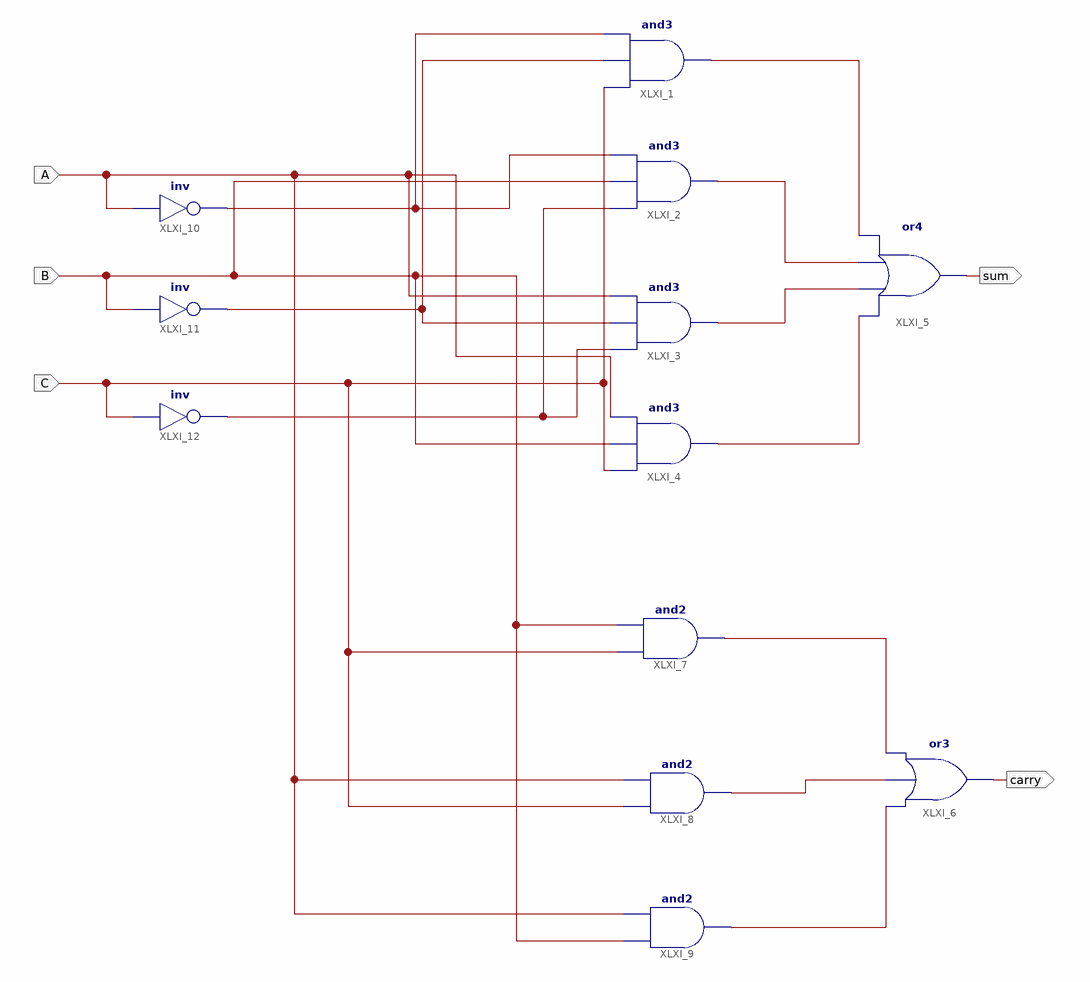
[diagram p0: schematic sheet 1]
// Xilinx ISE schematic full_adder.sch (spartan3adsp) as structural Verilog: 12 symbols, 5 ports
module full_adder (
  input  A,
  input  B,
  input  C,
  output sum,
  output carry
);

  wire XLXN_5, XLXN_6, XLXN_7, XLXN_8, XLXN_9, XLXN_10, XLXN_11, XLXN_17, XLXN_18, XLXN_21;

  and XLXI_1 (XLXN_5, C, XLXN_18, XLXN_17);
  and XLXI_2 (XLXN_6, XLXN_21, B, XLXN_17);
  and XLXI_3 (XLXN_7, XLXN_21, XLXN_18, A);
  and XLXI_4 (XLXN_8, C, B, A);
  or XLXI_5 (sum, XLXN_8, XLXN_7, XLXN_6, XLXN_5);
  or XLXI_6 (carry, XLXN_11, XLXN_10, XLXN_9);
  and XLXI_7 (XLXN_9, C, B);
  and XLXI_8 (XLXN_10, C, A);
  and XLXI_9 (XLXN_11, B, A);
  not XLXI_10 (XLXN_17, A);
  not XLXI_11 (XLXN_18, B);
  not XLXI_12 (XLXN_21, C);
endmodule
